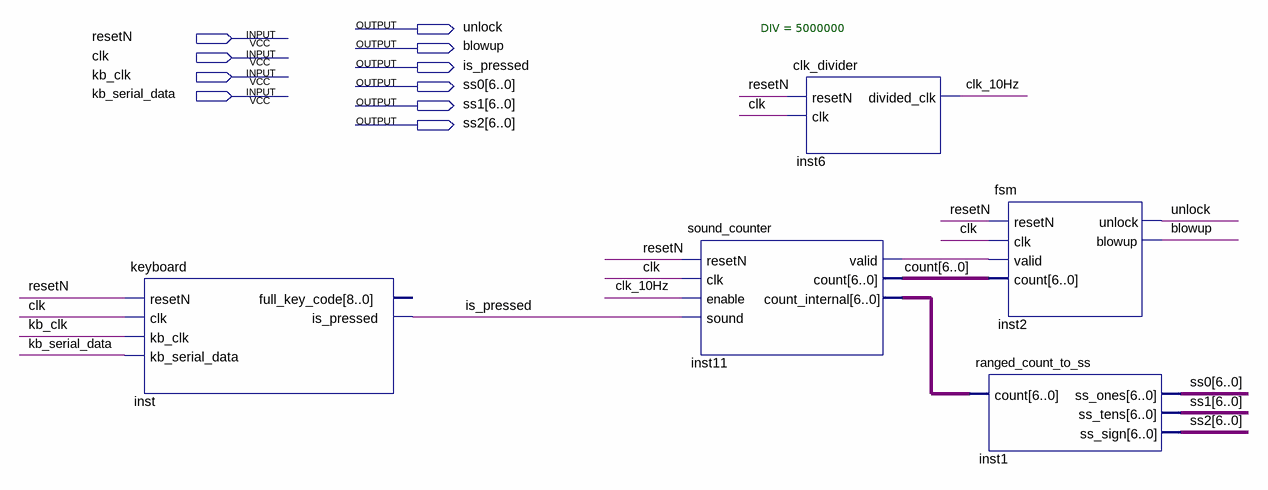
[diagram p0: schematic sheet]
// Quartus schematic fsm_from_kb.bdf as structural Verilog: 5 symbols, 10 pins
module fsm_from_kb (
  input  resetN,
  input  clk,
  input  kb_clk,
  input  kb_serial_data,
  output unlock,
  output blowup,
  output is_pressed,
  output [6:0] ss0,
  output [6:0] ss1,
  output [6:0] ss2
);

  wire clk_10Hz, inst11_valid;
  wire [6:0] count, inst11_count_internal;

  keyboard inst (
    .resetN(resetN), .clk(clk), .kb_clk(kb_clk), .kb_serial_data(kb_serial_data), .is_pressed(is_pressed));  // open: full_key_code
  sound_counter inst11 (
    .resetN(resetN), .clk(clk), .enable(clk_10Hz), .sound(is_pressed), .valid(inst11_valid), .count(count),
    .count_internal(inst11_count_internal));
  clk_divider #(.DIV(5000000)) inst6 (.resetN(resetN), .clk(clk), .divided_clk(clk_10Hz));
  fsm inst2 (.resetN(resetN), .clk(clk), .valid(inst11_valid), .count(count), .unlock(unlock), .blowup(blowup));
  ranged_count_to_ss inst1 (.count(inst11_count_internal), .ss_ones(ss0), .ss_tens(ss1), .ss_sign(ss2));
endmodule
